# Altium schematic sheet BiSS.SchDoc
size A3; Author: Швецов С.В.; Organization: PapuaSoft; SheetNumber: 4; SheetTotal: 8; PageSetup: Record=PageOptions|CenterHorizontal=True|CenterVertical=True|PrintScale=0.71|XCorrection=1.00|YCorrection=1.00|PrintKind=1|BorderSize=5000000|LeftOffset=0|BottomOffset=0|Orientation=2|PaperLength=1000|PaperWidth=1000|Scale=100|PaperSource=15|PrintQuality=600|MediaType=1|DitherType=10|PaperKind=A4|PrintScaleMode=1
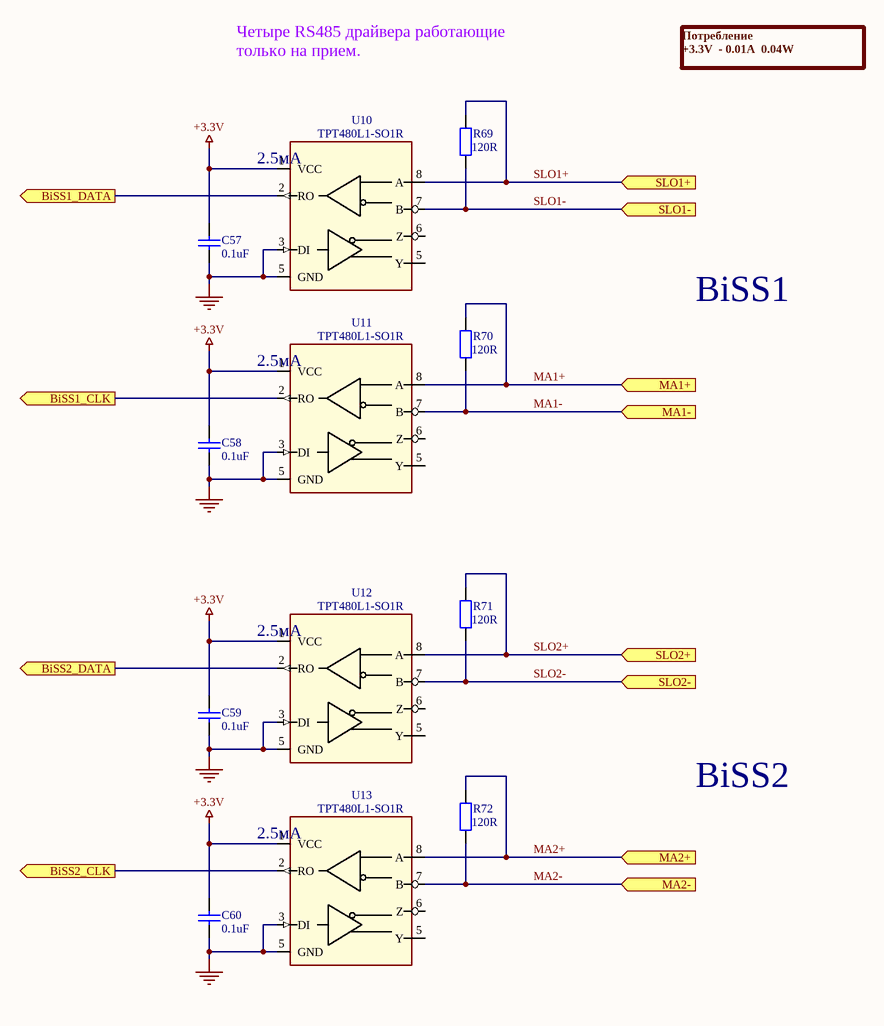
[diagram p0: BiSS.SchDoc]

## Parts
C57  value 0.1uF  [C0402]  (hidden comment: Cap)
C58  value 0.1uF  [C0402]  (hidden comment: Cap)
C59  value 0.1uF  [C0402]  (hidden comment: Cap)
C60  value 0.1uF  [C0402]  (hidden comment: Cap)
R69  value 120R  [R0402]  (hidden comment: Res2)
R70  value 120R  [R0402]  (hidden comment: Res2)
R71  value 120R  [R0402]  (hidden comment: Res2)
R72  value 120R  [R0402]  (hidden comment: Res2)
U10  TPT480L1-SO1R  [SO8]
U11  TPT480L1-SO1R  [SO8]
U12  TPT480L1-SO1R  [SO8]
U13  TPT480L1-SO1R  [SO8]

## Ports
BiSS1_CLK (out), BiSS1_DATA (out), BiSS2_CLK (out), BiSS2_DATA (out), MA1+ (in), MA1- (in), MA2+ (in), MA2- (in), SLO1+ (in), SLO1- (in), SLO2+ (in), SLO2- (in)

## Nets
+3.3V: C57.1 C58.1 C59.1 C60.1 U10.1(VCC) U11.1(VCC) U12.1(VCC) U13.1(VCC)
GND: C57.2 C58.2 C59.2 C60.2 U10.3(DI) U10.5(GND) U11.3(DI) U11.5(GND) U12.3(DI) U12.5(GND) U13.3(DI) U13.5(GND)
BiSS1_CLK: U11.2(RO) ; port BiSS1_CLK
BiSS1_DATA: U10.2(RO) ; port BiSS1_DATA
BiSS2_CLK: U13.2(RO) ; port BiSS2_CLK
BiSS2_DATA: U12.2(RO) ; port BiSS2_DATA
MA1+: R70.1 U11.8(A) ; port MA1+
MA1-: R70.2 U11.7(B) ; port MA1-
MA2+: R72.1 U13.8(A) ; port MA2+
MA2-: R72.2 U13.7(B) ; port MA2-
SLO1+: R69.1 U10.8(A) ; port SLO1+
SLO1-: R69.2 U10.7(B) ; port SLO1-
SLO2+: R71.1 U12.8(A) ; port SLO2+
SLO2-: R71.2 U12.7(B) ; port SLO2-

Not connected (* = marked no-connect by the designer): U10 6(Z); U11 6(Z); U12 6(Z); U13 6(Z)

## Notes on the sheet
- Потребление
  +3.3V  - 0.01A  0.04W
- (near R69) Четыре RS485 драйвера работающие только на прием.
- (near U10) 2.5мА
- BiSS1
- (near U11) 2.5мА
- (near U12) 2.5мА
- BiSS2
- (near U13) 2.5мА
- Лист
- /
- Изм.
- № докум.
- Подп.
- Дата.

## Library data of the parts
C57-C60 = Cap: Конденсатор керамический; Voltage: 25V; PackageReference: 0402; ClassName: BiSS
R69-R72 = Res2: Резистор; PackageReference: 0402; ClassName: BiSS
U10-U13 = MAX3078E: RS-485 Transievers; PackageReference: SO8; Value: TPT480L1-SO1R; ClassName: BiSS